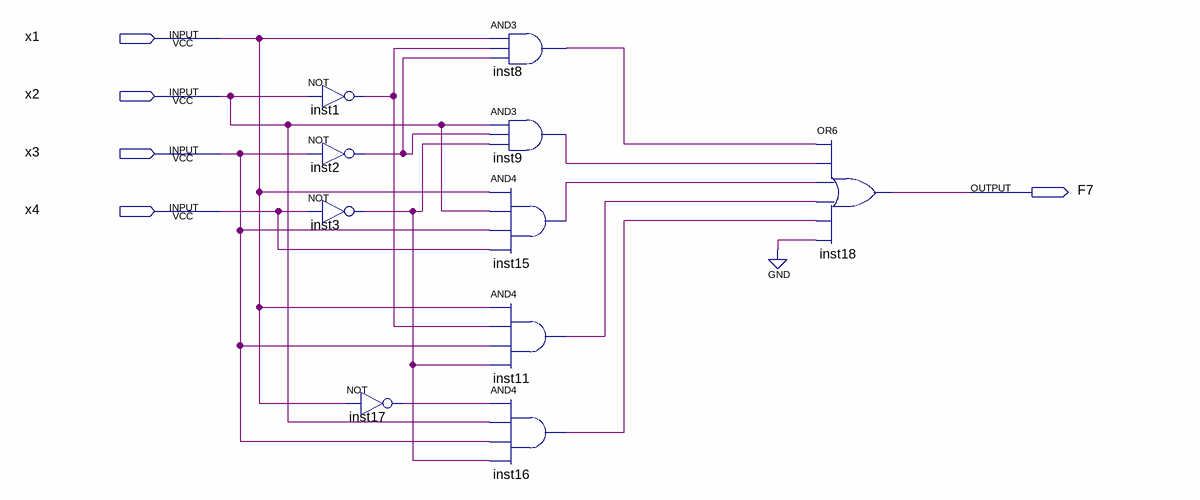
[diagram p0: schematic sheet]
// Quartus schematic lab2.bdf as structural Verilog: 10 symbols, 5 pins
module lab2 (
  input  x1,
  input  x2,
  input  x3,
  input  x4,
  output F7
);

  wire inst1_out, inst2_out, inst3_out, inst8_out, inst9_out, inst11_out, inst15_out, inst16_out, inst17_out;

  not inst1 (inst1_out, x2);
  not inst2 (inst2_out, x3);
  not inst3 (inst3_out, x4);
  not inst17 (inst17_out, x1);
  and inst8 (inst8_out, x1, inst1_out, inst2_out);
  and inst9 (inst9_out, x2, inst2_out, inst3_out);
  and inst15 (inst15_out, x1, x2, x3, x4);
  and inst11 (inst11_out, x1, inst1_out, x3, inst3_out);
  and inst16 (inst16_out, inst17_out, x2, x3, inst3_out);
  or inst18 (F7, inst8_out, inst9_out, inst15_out, inst11_out, inst16_out, 1'b0);
endmodule
